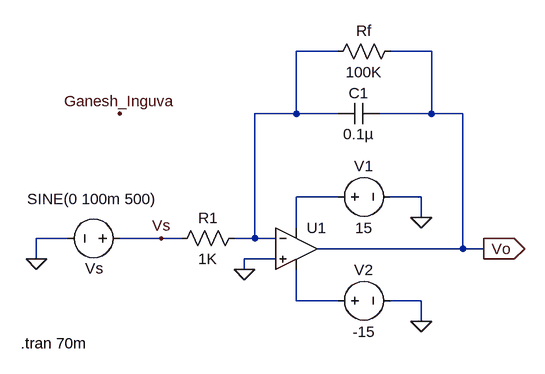
[diagram p0: schematic Run2_C.asc]
Run2_C.asc, the LTspice schematic file:
Version 4
SHEET 1 880 680
WIRE 224 -64 160 -64
WIRE 368 -64 304 -64
WIRE 160 32 160 -64
WIRE 160 32 96 32
WIRE 224 32 160 32
WIRE 368 32 368 -64
WIRE 368 32 288 32
WIRE 416 32 368 32
WIRE 224 160 160 160
WIRE 352 160 304 160
WIRE 352 192 352 160
WIRE 160 208 160 160
WIRE -192 224 -240 224
WIRE -48 224 -112 224
WIRE -16 224 -48 224
WIRE 96 224 96 32
WIRE 96 224 64 224
WIRE 128 224 96 224
WIRE 416 240 416 32
WIRE 416 240 192 240
WIRE 448 240 416 240
WIRE -240 256 -240 224
WIRE 128 256 80 256
WIRE 80 272 80 256
WIRE 160 320 160 272
WIRE 224 320 160 320
WIRE 352 320 304 320
WIRE 352 352 352 320
FLAG 352 192 0
FLAG 352 352 0
FLAG -240 256 0
FLAG 80 272 0
FLAG 448 240 Vo
IOPIN 448 240 Out
FLAG -48 224 Vs
FLAG -112 32 Ganesh_Inguva
SYMBOL OpAmps\\UniversalOpamp2 160 240 R0
SYMATTR InstName U1
SYMBOL voltage 208 160 R270
WINDOW 0 32 56 VTop 2
WINDOW 3 -32 56 VBottom 2
WINDOW 123 0 0 Left 0
WINDOW 39 0 0 Left 0
SYMATTR InstName V1
SYMATTR Value 15
SYMBOL voltage 208 320 R270
WINDOW 0 32 56 VTop 2
WINDOW 3 -32 56 VBottom 2
WINDOW 123 0 0 Left 0
WINDOW 39 0 0 Left 0
SYMATTR InstName V2
SYMATTR Value -15
SYMBOL res 80 208 R90
WINDOW 0 0 56 VBottom 2
WINDOW 3 32 56 VTop 2
SYMATTR InstName R1
SYMATTR Value 1K
SYMBOL voltage -96 224 R90
WINDOW 0 62 55 VBottom 2
WINDOW 3 -76 58 VTop 2
WINDOW 123 0 0 Left 0
WINDOW 39 0 0 Left 0
SYMATTR InstName Vs
SYMATTR Value SINE(0 100m 500)
SYMBOL cap 288 16 R90
WINDOW 0 0 32 VBottom 2
WINDOW 3 32 32 VTop 2
SYMATTR InstName C1
SYMATTR Value 0.1µ
SYMBOL res 320 -80 R90
WINDOW 0 0 56 VBottom 2
WINDOW 3 32 56 VTop 2
SYMATTR InstName Rf
SYMATTR Value 100K
TEXT -264 386 Left 2 !.tran 70m

The netlist it stands for:
* Run2_C.asc
XU1 0 N001 N002 N003 Vo level.2 Avol=1Meg GBW=10Meg Slew=10Meg ilimit=25m rail=0 Vos=0 phimargin=45 en=0 enk=0 in=0 ink=0 Rin=500Meg  ; pins IN+ IN- V+ V- OUT
V1 N002 0 15
V2 N003 0 -15
R1 N001 Vs 1K
Vs Vs 0 SINE(0 100m 500)
C1 Vo N001 0.1µ
Rf Vo N001 100K
.tran 70m
.lib UniversalOpamps2.sub
.backanno
.end